# Altium schematic sheet Main.SchDoc
size 110 x 100 mm
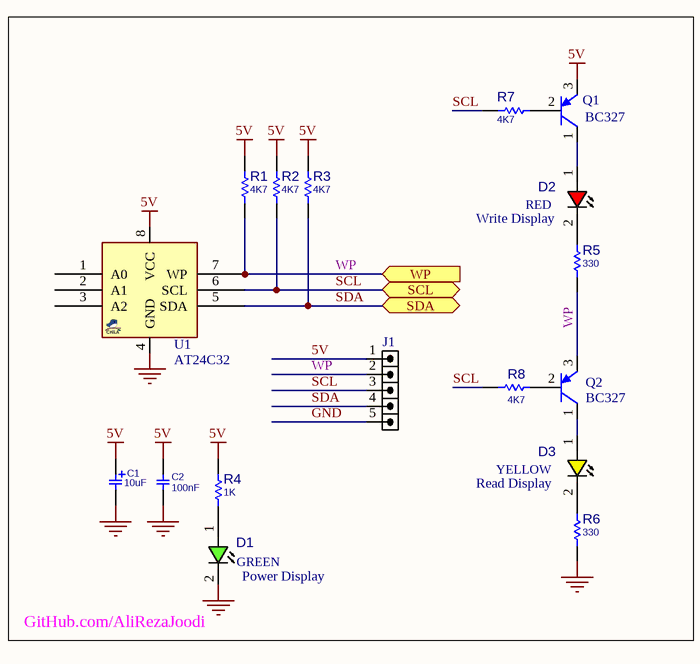
[diagram p0: Main.SchDoc]

## Parts
C1  10uF  [C_EL_6X11]
C2  100nF  [C_CER_D3]
D1  GREEN  [LED5MM_GRN]
D2  RED  [LED5MM_RED]
D3  YELLOW  [LED5MM_YLW]
J1  HDR1X5  [HDR_M_1X5]  (value not drawn)
Q1  BC327  [TO92_3A]
Q2  BC327  [TO92_3A]
R1  4K7  [R025W_AX04]
R2  4K7  [R025W_AX04]
R3  4K7  [R025W_AX04]
R4  1K  [R025W_AX04]
R5  330  [R025W_AX04]
R6  330  [R025W_AX04]
R7  4K7  [R025W_AX04]
R8  4K7  [R025W_AX04]
U1  AT24C32  [DIP_8]

## Ports
SCL (bidir), SDA (bidir), WP (in)

## Nets
5V: C1.1 C2.2 J1.1 Q1.3(E) R1.2 R2.2 R3.2 R4.2 U1.8(VCC)
GND: C1.2 C2.1 D1.2(CATHODE) J1.5 R6.2 U1.4(GND)
SCL: J1.3 R2.1 R7.2 R8.2 U1.6(SCL) ; port SCL
SDA: J1.4 R3.1 U1.5(SDA) ; port SDA
WP: J1.2 Q2.3(E) R1.1 R5.2 U1.7(WP) ; port WP
NetD1_1: D1.1(ANODE) R4.1
NetD2_1: D2.1(ANODE) Q1.1(C)
NetD2_2: D2.2(CATHODE) R5.1
NetD3_1: D3.1(ANODE) Q2.1(C)
NetD3_2: D3.2(CATHODE) R6.1
NetQ1_2: Q1.2(B) R7.1
NetQ2_2: Q2.2(B) R8.1

Not connected (* = marked no-connect by the designer): U1 1(A0) 2(A1) 3(A2)

## Notes on the sheet
- (near D2) Write Display
- Read Display
- (near D1) Power Display
- (near D1) GitHub.com/AliRezaJoodi

## Library data of the parts
C1 = CAP_THD_EL_10u25V: CAP, THD, ELEC, 10uF, 25V; MANF_P#: MANF_PART#; PARAM: 25V; MANF: MANF; PARAM2: PARAM2; VALUE: 10uF
C2 = CAP_THD_CERML: CAP, THD, CER MULTI LAYER,; PARAM: 50V; DESC: CAP, CER MULTI LAYER,; MANF_P#: MANF_PART#; VALUE: 330nF; PRICE: 100= 1$; MANF: MANF; PARAM2: PARAM2; ASSEMBLY: ASSEMBLY
D1 = LED_THD_5MM_GRN: LED, THD, 5MM, GREEN; DESC: DESCRIPTION; MANF_P#: MANF_PART#; PARAM2: 2.2V; VALUE: LED5MM_GRN; MANF: MANF; ASSEMBLY: ASSEMBLY; PRICE: PRICE
D2 = LED_THD_5MM_RED: LED, THD, 5MM, RED; Role: Write Display; PARAM2: 2.2V
D3 = LED_THD_5MM_YLW: LED, THD, 5MM, YELLOW; Role: Read Display; PARAM2: 2.2V; ASSEMBLY: ASSEMBLY
J1 = HDR_M_1X5: CONN, HEADER, Male, pitch: 2.54mm, 5POS; VALUE: HDRM5
Q1 Q2 = PNP_BC557_TO92: BJT, PNP, 45v, 0.1A, THD, TO92; PARAM2: 500mW; MANF_P#: BC557; MANF: MULTICOMP; VALUE: BC557; PARAM: 45v, 0.1A
R1-R8 = RES_THD: RESISTOR, THD; MANF_P#: RK73H1ETTP4701F; MANF: KOA SPEER; PARAM: 0.063W; DESC: DESCRIPTION; DIST#: MOUSER; PARAM2: 1%; ASSEMBLY: ASSEMBLY; PRICE: 100= 0.5$
  R1-R3 R7 R8: VALUE: 4K7
  R4: VALUE: 1K
  R5 R6: VALUE: 330
U1 = EEPROM_I2C_CAT24C64_DIP8: EEPROM, I2C, 64Kbit (8K X8); MANF: ON; MANF_P#: CAT24C64LI-G; PARAM2: 2.5~5V, 100Years; PARAM: 32Kbit (4K X8), 400KHz, -40~85oC; PRICE: 0.4$; VALUE: AT24C32